# Altium project TSAL_New.PrjPcb
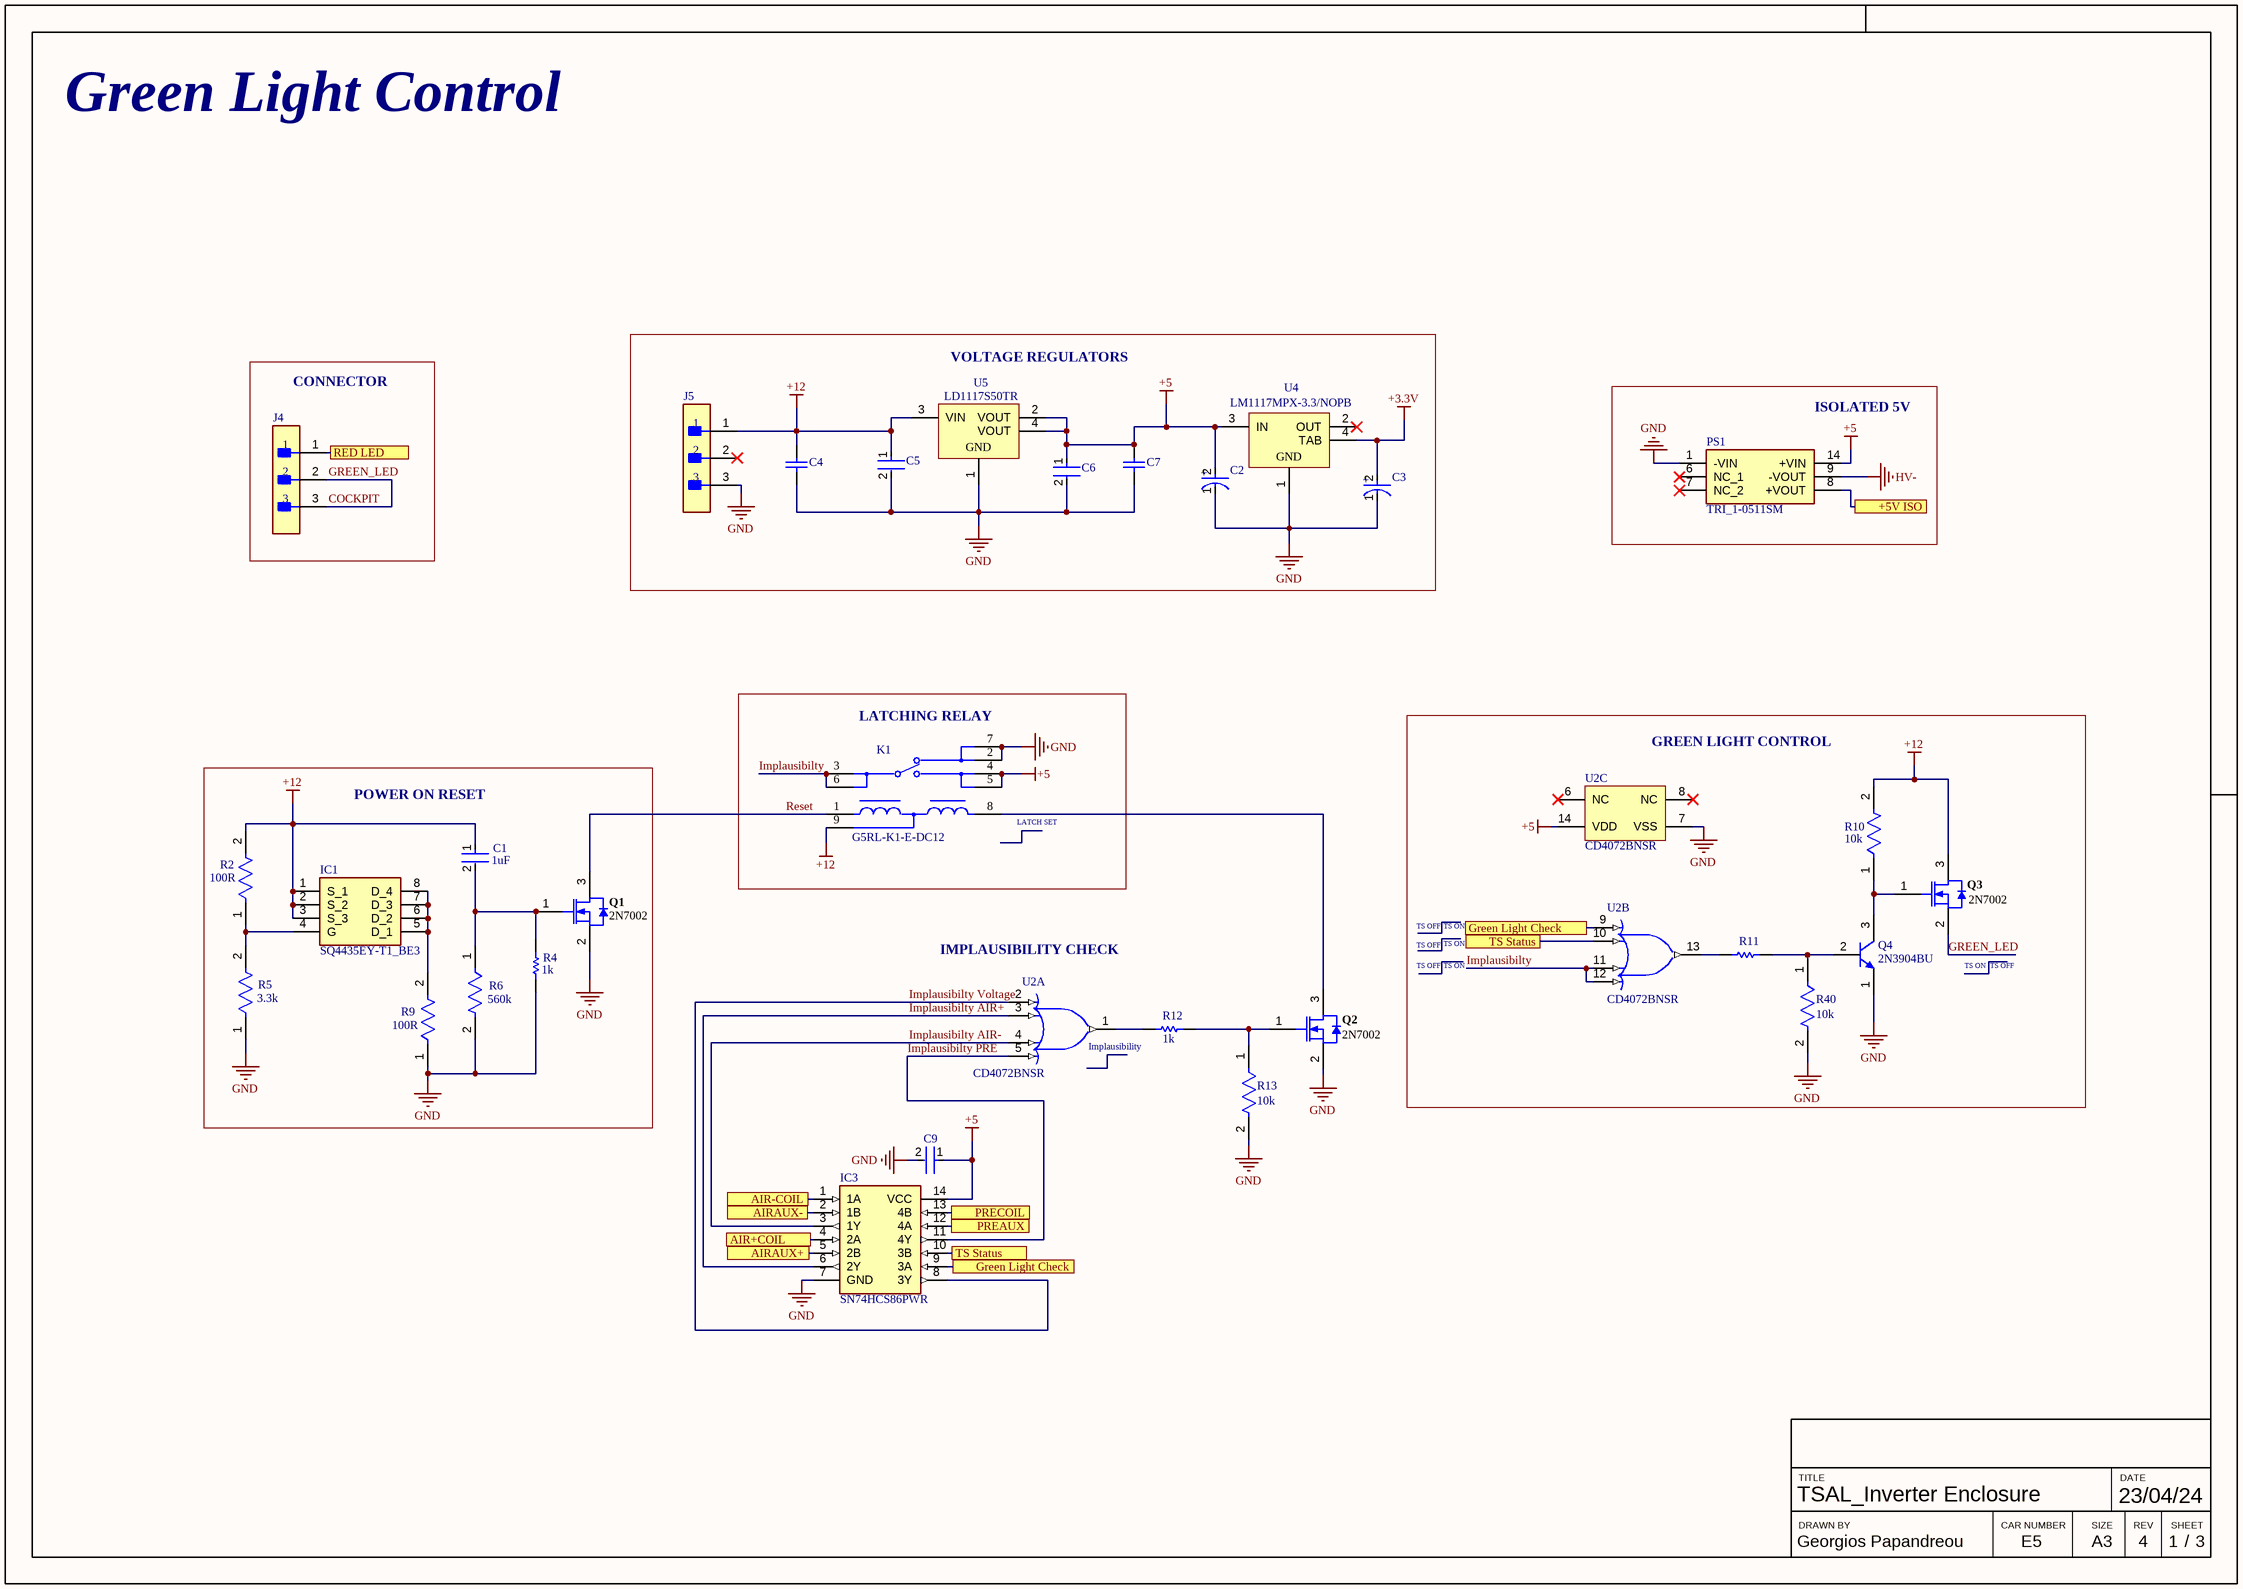
[diagram p0: Green_Light_Check.SchDoc]
CAGE_CODE: ?????; CONTRACT_NUMBER: <CONTRACT NO>; DOC_NO_ASSY_DWG: <ASSY DWG NO>; DOC_NO_BOM: <BOM DOC NO>; DOC_NO_FAB_DWG: <FAB DWG NO>; DOC_NO_SCH_DWG: <SCH DWG NO>; PCB_2_DEC_TOL: +/-.01; PCB_3_DEC_TOL: +/-.010; PCB_ANG_TOL: +/-1/2; PCB_ASSEMBLY_NO: <PCB ASSY NO>; PCB_CHECKER: - -----; PCB_CHECKER_APP_DATE: --/--/----; PCB_DESIGNER: - -----; PCB_DESIGNER_APP_DATE: --/--/----; PCB_DWG_NO: <PCB DWG NO>; PCB_ENGINEER: - -----; PCB_ENGINEER_APP_DATE: --/--/----; PCB_PART_NUMBER: <PCB PN>; PCB_REV: A; SCH_REV: A
4 sheets, 85 parts. Net scope: flat (ports and power ports of the same name join across sheets).
Board files: TSAL_New.PcbDoc, TSAL_ver2.PcbDoc
Sheets:
  Green_Light_Check.SchDoc
  Red_Light_Check.SchDoc
  TSAC_Logic.SchDoc
  CI.SchDoc

## Sheet Green_Light_Check.SchDoc: TSAL_Inverter Enclosure
size 420 x 297 mm; Date: 23/04/24; DrawnBy: Georgios Papandreou; Revision: 4; SheetNumber: 1; SheetTotal: 4; CarNum: E5; CurrentSheet: 1; TotalSheet: 3

### Parts
C1  CGA5L2X7R1E105K160AA  [FP-CGA5L-0_3-0_1-MFG]  (value not drawn)
C2  TAJP106M010RNJ  [FP-TAJP-MFG]  (value not drawn)
C3  TAJP106M010RNJ  [FP-TAJP-MFG]  (value not drawn)
C4  C1206C106K8RACTU  [CAPC3216X180X50LL20T25]  (value not drawn)
C5  CL21B104KBCNNNC  [FP-CL21-IPC_C]  (value not drawn)
C6  CL21B104KBCNNNC  [FP-CL21-IPC_C]  (value not drawn)
C7  C1206C106K8RACTU  [CAPC3216X180X50LL20T25]  (value not drawn)
C9  CL21B104KBCNNNC  [FP-CL21-IPC_C]  (value not drawn)
IC1  SQ4435EY-T1_BE3  [SOIC127P600X175-8N]
IC3  SN74HCS86PWR  [SOP65P640X120-14N]
J4  22-04-1031  [FP-22-04-1031-MFG]  (value not drawn)
J5  22-04-1031  [FP-22-04-1031-MFG]  (value not drawn)
K1  G5RL-K1-E-DC12  [FP-G5RL-K1-E-DC12-MFG]
PS1  TRI_1-0511SM  [TRI10511SM]
Q1  2N7002  [INF-PG-SOT23_M]
Q2  2N7002  [INF-PG-SOT23_M]
Q3  2N7002  [INF-PG-SOT23_M]
Q4  2N3904BU  [FAIR-TO-92]
R2  CRCW1206100RFKEA  [FP-CRCW1206-e3-MFG]  (value not drawn)
R4  1K 1% 1206(3216)  [RESC1206(3216)_N]  (value not drawn)
R5  CRCW12063K30FKEB  [FP-CRCW1206-e3-IPC_B]  (value not drawn)
R6  RT1206BRD07560KL  [FP-RT1206-MFG]  (value not drawn)
R9  CRCW1206100RFKEA  [FP-CRCW1206-e3-MFG]  (value not drawn)
R10  CRCW120610K0FKEA  [FP-CRCW1206-e3-IPC_C]  (value not drawn)
R11  RK73B2ATTD102J  [RESC2013X60X30ML20T20]  (value not drawn)
R12  RK73B2ATTD102J  [RESC2013X60X30ML20T20]  (value not drawn)
R13  CRCW120610K0FKEA  [FP-CRCW1206-e3-IPC_C]  (value not drawn)
R40  CRCW120610K0FKEA  [FP-CRCW1206-e3-IPC_C]  (value not drawn)
U2  CD4072BNSR  [NS0014A_M]  (parts A,B,C of 3)
U4  LM1117MPX-3.3/NOPB  [DCY0004A_L]
U5  LD1117S50TR  [SOT-223_L]

### Blocks framed on the sheet
CONNECTOR: J4
VOLTAGE REGULATORS: C2-C7 J5 U4 U5
ISOLATED 5V: PS1
LATCHING RELAY: K1
GREEN LIGHT CONTROL: Q3 Q4 R10 R11 R40 U2
POWER ON RESET: C1 IC1 Q1 R2 R4-R6 R9

### Ports
+5V ISO (see Red_Light_Check[3C], Red_Light_Check[4B], TSAC_Logic[4B], TSAC_Logic[5A]), AIR+COIL (see TSAC_Logic[4B]), AIR-COIL (see TSAC_Logic[4B]), AIRAUX+ (see TSAC_Logic[4B]), AIRAUX- (see TSAC_Logic[4B]), Green Light Check (see Green_Light_Check[3D], TSAC_Logic[4B]), Green Light Check (see Green_Light_Check[4C], TSAC_Logic[4B]), PREAUX (see TSAC_Logic[5B]), PRECOIL (see TSAC_Logic[5B]), RED LED (see Red_Light_Check[3C]), TS Status (see Green_Light_Check[3D], TSAC_Logic[6C]), TS Status (see Green_Light_Check[4C], TSAC_Logic[6C])

### Nets
+3.3V: C3.2(A) U4.4(TAB)
+5: C2.2(A) C6.1 C7.2 C9.1 IC3.14(VCC) K1.4 K1.5 PS1.14(+VIN) U2.14(VDD) U4.3(IN) U5.2(VOUT) U5.4(VOUT)
+12: C1.1 C4.2 C5.1 IC1.1(S_1) IC1.2(S_2) IC1.3(S_3) J5.1 K1.9(S+/R+) Q3.3(DRAIN) R2.2 R10.2 U5.3(VIN)
GND: C2.1(C) C3.1(C) C4.1 C5.2 C6.2 C7.1 C9.2 IC3.7(GND) J5.3 K1.2 K1.7 PS1.1(-VIN) Q1.2(SOURCE) Q2.2(SOURCE) Q4.1(E) R4.1 R5.1 R6.2 R9.1 R13.2 R40.2 U2.7(VSS) U4.1(GND) U5.1(GND)  [project net AIR+/AUX-]
HV-: PS1.9(-VOUT)
+5V ISO: PS1.8(+VOUT) ; port +5V ISO
AIR+COIL: IC3.4(2A) ; port AIR+COIL
AIR-COIL: IC3.1(1A) ; port AIR-COIL
AIRAUX+: IC3.5(2B) ; port AIRAUX+
AIRAUX-: IC3.2(1B) ; port AIRAUX-
COCKPIT: J4.2 J4.3 Q3.2(SOURCE)  [also labelled GREEN_LED]
Green Light Check: IC3.9(3A) U2.9(E) ; port Green Light Check
Implausibilty: K1.3 K1.6 U2.11(G) U2.12(H)
Implausibilty AIR+: IC3.6(2Y) U2.3(B)
Implausibilty AIR-: IC3.3(1Y) U2.4(C)
Implausibilty PRE: IC3.11(4Y) U2.5(D)
Implausibilty Voltage: IC3.8(3Y) U2.2(A)
PREAUX: IC3.12(4A) ; port PREAUX
PRECOIL: IC3.13(4B) ; port PRECOIL
RED LED: J4.1 ; port RED LED
Reset: K1.1(R-) Q1.3(DRAIN)
TS Status: IC3.10(3B) U2.10(F) ; port TS Status
NetC1_2: C1.2 Q1.1(GATE) R4.2 R6.1
NetIC1_4: IC1.4(G) R2.1 R5.2
NetIC1_5: IC1.5(D_1) IC1.6(D_2) IC1.7(D_3) IC1.8(D_4) R9.2
NetK1_8: K1.8(S-) Q2.3(DRAIN)
NetQ2_1: Q2.1(GATE) R12.2 R13.1
NetQ3_1: Q3.1(GATE) Q4.3(C) R10.1
NetQ4_2: Q4.2(B) R11.2 R40.1
NetR11_1: R11.1 U2.13(K)
NetR12_1: R12.1 U2.1(J)

Not connected (* = marked no-connect by the designer): J5 2*; PS1 6(NC_1)* 7(NC_2)*; U2 6(NC)* 8(NC)*; U4 2(OUT)*

### Notes on the sheet
- Green Light Control
- (near C1) 1uF
- (near K1) LATCH SET
- (near R10) 10k
- (near R2) 100R
- TS OFF
- TS ON
- (near R5) 3.3k
- (near R6) 560k
- (near R4) 1k
- (near U2) IMPLAUSIBILITY CHECK
- (near R9) 100R
- (near U2) Implausibility
- (near R12) 1k
- (near R40) 10k
- (near R13) 10k
- TITLE
- DATE
- DRAWN BY
- CAR NUMBER
- SIZE
- REV
- SHEET
- A3
- /
- (in symbol CMP-2007-04028-2) +

### Library data of the parts
C1 = CMP-08246-001699-1: Cap Ceramic 1uF 25V X7R 10% Pad SMD 1206 +125°C Automotive T/R; Max Operating Temperature: 125°C; Weight: 0.000571oz; Package Quantity: 2000; Width: 1.6mm; Voltage Rating: 25V; REACH SVHC: No SVHC; Height: 1.6mm; Min Operating Temperature: -55°C; Mount: Surface Mount; Case/Package: 1206; Ratings: AEC-Q200; Case Code (Imperial): 1206; Capacitance: 1uF; Termination: SMD/SMT; Length: 3.2mm; Depth: 1.6mm; Thickness: 0.075inch; Packaging: Tape and Reel; Tolerance: 10%; Dielectric: X7R; Case Code (Metric): 3216; Voltage Rating (DC): 25V; Composition: Ceramic
C2 C3 = CMP-2007-04028-2: 10uF 10V  ±20% 6Ω 0805  SMD Tantalum Capacitor; Dissipation Factor: 8%; ESR (Equivalent Series Resistance): 6R; Polarity: Polar; Leakage Current: 1uA; Height: 1.5mm; Packaging: Tape and Reel; Max Operating Temperature: 125°C; Lead Free: Lead Free; Length: 2.05mm; RoHS Compliant: Yes; Number of Pins: 2; Case Code (Metric): 2012; Series: TAJ; Height - Seated (Max): 0.059inch; Mount: Surface Mount; REACH SVHC: No SVHC; Depth: 1.35mm; Tolerance: 20%; Case Code (Imperial): 0805; Dielectric Material: Tantalum; Features: General Purpose; Voltage: 10V; Capacitance: 10uF; Package Quantity: 1; Case/Package: 0805; Voltage Rating (DC): 10V; Termination: SMD/SMT; Width: 0.053inch; Min Operating Temperature: -55°C; Voltage Rating: 10V
C4 C7 = CMP-2000-06013-1: Chip Capacitor, 10 uF, +/- 10%, 10 V, -55 to 125 degC, 1206 (3216 Metric), RoHS, Tape and Reel; Type: SMDMLCCX7R6.3-250VDCCommericalGrade; Class: Class1; Case Height: 1.6mm; Temperature Coefficient / Code: +/-15%; Capacitance: 10uF; Brand: Kemet; Case Length: 3.2mm; Dissipation Factor DF: 5; Voltage Rating: 10V; Dielectric: X7R; Tolerance: 10%; Package Reference: 1206; Dimensions: 1.6mmWx3.2mmLx1.6mmH; Series: C1206C; Minimum Operating Temperature: -55C; RoHS: Details; Termination Style: SMD/SMT; Mounting Technology: SurfaceMount; Manufacturer: Kemet; Product Category: MultilayerCeramicCapacitorsMLCC-SMD/SMT; Case Code - mm: 3216; Manufacturer URL: http://www.kemet.com/; Product: GeneralTypeMLCCs; Package Description: 2-Pin Surface Mount Device, Body 3.2 x 1.6 mm; Case Width: 1.6mm; Factory Pack Quantity: 2000; Package / Case: 1206(3216metric); Datasheet URL: http://www.kemet.com/docfinder?Partnumber=C1206C106K8RACTU; Datasheet Version: 02/2016; Operating Temperature Range: -55Cto+125C; Voltage Rating DC: 10V; Case Code - in: 1206; Maximum Operating Temperature: +125C; Packaging: Reel
C5 C6 C9 = CMP-2000-05017-2: CL21 Series 0805 100nF 50V ±10% Tolerance X7R Multilayer Ceramic Chip Capacitor; Depth: 1.25mm; Height: 0.85mm; Width: 0.049inch; Tolerance: 10%; Case Code (Metric): 2012; Case Code (Imperial): 0805; Material: Ceramic; Thickness: 0.037inch; Min Operating Temperature: -55°C; Contact Plating: Tin; Length: 2mm; Mount: Surface Mount; Voltage Rating (DC): 50V; Lead Free: Lead Free; Dielectric: X7R; Radiation Hardening: No; Capacitance: 100nF; Voltage Rating: 50V; Case/Package: 0805; Packaging: Tape and Reel; Max Operating Temperature: 125°C; Voltage: 50V
IC1 = SQ4435EY-T1_BE3: Integrated Circuit; Manufacturer_Name: Vishay; Datasheet Link: https://www.arrow.com/en/products/sq4435ey-t1-be3/vishay?region=nac; Height: 1.75mm; Manufacturer_Part_Number: SQ4435EY-T1_BE3; Mouser Part Number: 78-SQ4435EY-T1_BE3; Mouser Price/Stock: https://www.mouser.co.uk/ProductDetail/Vishay-Semiconductors/SQ4435EY-T1_BE3?qs=vmHwEFxEFR%2FvbkkgD6xsvQ%3D%3D; Arrow Part Number: SQ4435EY-T1_BE3; Arrow Price/Stock: https://www.arrow.com/en/products/sq4435ey-t1-be3/vishay?region=nac
IC3 = SN74HCS86PWR: Integrated Circuit; Manufacturer_Name: Texas Instruments; Datasheet Link: https://www.digikey.de/product-detail/de/texas-instruments/SN74HCS86PWR/296-SN74HCS86PWRCT-ND/11615756; Height: 1.2mm; Manufacturer_Part_Number: SN74HCS86PWR; Mouser Part Number: 595-SN74HCS86PWR; Mouser Price/Stock: https://www.mouser.co.uk/ProductDetail/Texas-Instruments/SN74HCS86PWR?qs=GBLSl2Akirvjol1GHn5SIA%3D%3D; Arrow Part Number: SN74HCS86PWR; Arrow Price/Stock: https://www.arrow.com/en/products/sn74hcs86pwr/texas-instruments?region=nac
J4 J5 = CMP-04776-000410-1: CONN HEADER VERT 3POS 2.5MM; Voltage Rating (AC): 250V; Number of Contacts: 3; Max Voltage Rating (DC): 250.25kV; Contact Resistance: 20mR; Hole Diameter: 1.19mm; Gender: Male; Connector Type: Male Pin; Insulation Resistance: 1GR; Glow Wire Compliant: Non-compliant; Current Rating: 3A; Contact Material: Brass; Series: KK; Number of Positions: 3; Contact Gender: Male; Mount: Through Hole; Working Voltage: 250V; Number of Poles: 3; Termination: Solder; Radiation Hardening: No; Lead Free: Lead Free; Min Operating Temperature: -40°C; Contact Mating Length: 0.295inch; Packaging: Bulk; Lead Pitch: 2.5mm; Voltage Rating: 250V; Voltage Rating (DC): 250V; Orientation: Straight; Color: Natural; Flammability Rating: UL94 V-0; Housing Material: Nylon; Pitch: 2.5mm; Contact Type: Male Pin; Number of Rows: 1; Housing Color: Natural; Max Operating Temperature: 105°C; Fastening Type: Friction; Halogen Free: Low Halogen; Contact Plating: Tin; Package Quantity: 1; Number of Circuits: 3
K1 = CMP-08822-000183-1: RELAY GEN PURPOSE SPDT 16A 12V; Relay Type: General Purpose; Coil Type: Latching, Dual Coil; Coil Resistance: 192R; Release Time: 15ms; Coil Current: 62.5mA; Coil Power: 750mW; Contact Current Rating: 16A; Termination: PC Pin; Max Operating Temperature: 85°C; Min Operating Temperature: -40°C; Mount: Through Hole; Coil Voltage (DC): 12V; Operate Time: 15ms; REACH SVHC: No SVHC; Packaging: Rail/Tube; Throw Configuration: SPDT; Package Quantity: 100; Contact Material: Silver
PS1 = TRI_1-0511SM: Power Supply; Manufacturer_Name: Traco Power; Manufacturer_Part_Number: TRI 1-0511SM; Datasheet Link: https://tracopower.com/tri1sm-datasheet/; Height: 11mm
Q1-Q3 = CMP-1149-00026-1: N-Channel OptiMOS Small-Signal-Transistor, 60 V VDS, 0.3 A ID, -55 to 150 degC, PG-SOT23, Reel, Green; Manufacturer: Infineon; RDS (on) (max) (@4.5V): 4,000 mOhm; VDS (max): 60 V; IDpuls (max): 1.2Â A; QG: 0.4Â nC; RDS (on) (max): 3,000 mOhm; RthJA (max): 250 K/W; ID (max): 0.3Â A; VGS(th) (max): 2.5Â V; VGS(th) (min): 1.5Â V; Green: TRUE; Ptot (max): 0.5Â W; PackageDescription: 3-Pin Small Outline Transistor Package, 2.9 x 1.3 mm Body, 0.95 mm Pitch; Halogen-free: TRUE; ComponentLink2Description: Datasheet; ComponentLink1URL: http://www.infineon.com/; Packing: Reel; DatasheetVersion: Rev. 2.4; PartNumber: 2N7002; PackageReference: PG-SOT23; PackageVersion: Apr-08; ComponentLink3URL: http://www.infineon.com/dgdl/SOT23-Package_Overview.pdf?folderId=db3a30431936bc4b0119532290053c66&fileId=db3a30431936bc4b0119533468123c85; ComponentLink1Description: Manufacturer URL; Mounting Technology: Surface Mount; ComponentLink3Description: Package Specification; ComponentLink2URL: http://www.infineon.com/dgdl/2N7002_Rev2.4.pdf?folderId=db3a3043156fd573011622e10b5c1f67&fileId=db3a304319bc939a0119c2a9461e79e6
Q4 = CMP-2000-04944-1: NPN General-Purpose Amplifier, 40 V VCEO, 0.2 A, -55 to 150 degC, 2-Pin TO-92, RoHS, Bulk; Manufacturer: FairchildSemiconductor; Maximum Collector Base Voltage: 60V; Minimum DC Current Gain: 40@0.1mA@1V; Maximum Collector Emitter Voltage: 40V; Maximum DC Collector Current: 0.2A; Rad Hard: No; Maximum Operating Frequency: 300(Min)MHz; Maximum Collector Emitter Saturation Voltage: 0.2@1mA@10mA; Maximum Power Dissipation: 625mW; Package Description: 3-Pin Transistor Outline Package, Body Dia 4.79 mm, Pitch 1.27 mm; Package Reference: TO-92; Pin Count: 3; Operating Temperature: -55to150degC; Category: GPBJT; Manufacturer URL: https://www.fairchildsemi.com/; Datasheet URL: https://datasheet.ciiva.com/4722/2n3904-82270-4722369.pdf; Package: 3TO-92; Packaging: Bulk; Type: NPN; Datasheet Version: Rev. 1.1.0, 10/2014; Mounting: ThroughHole
R2 R9 = CMP-2003-04801-2: RES Thick Film, 100Ω, 1%, 0.25W, 100ppm/°C, 1206; Voltage Rating (DC): 200V; Resistance: 100R; Power Rating: 250mW; Case Code (Metric): 3216; Radiation Hardening: No; Height: 0.55mm; Packaging: Tape and Reel; Depth: 1.6mm; Weight: 0.000353oz; Termination: SMD/SMT; Lead Free: Lead Free; Min Operating Temperature: -55°C; Contact Plating: Tin; Max Operating Temperature: 155°C; Case Code (Imperial): 1206; Military Standard: Not; Width: 1.6mm; Number of Pins: 2; Voltage Rating: 200V; Composition: Thick Film; Package Quantity: 5000; Tolerance: 1%; Case/Package: 1206; Mount: Surface Mount; Length: 3.2mm; Temperature Coefficient: 100ppm/°C
R4 = CMP-1014-00510-1: 1K 0.25W 1% 1206 (3216 Metric)  SMD; Case-Metric: 3216; Case-EIA: 1206; Value: 1000.00 Ohm; Power: 0.25 W; Tolerance: 1 %; Technology: SMT
R5 = CMP-02407-003770-1: RES Thick Film, 3.3kΩ, 1%, 0.25W, 100ppm/°C, 1206; Voltage Rating: 200V; Max Power Dissipation: 250mW; Resistance: 3.3kR; Temperature Coefficient: 100ppm/°C; Width: 0.063inch; Package Quantity: 10000; Min Operating Temperature: -55°C; Lead Free: Lead Free; Packaging: Tape and Reel; Termination: SMD/SMT; Max Operating Temperature: 155°C; Case Code (Imperial): 1206; Height: 0.024inch; Case/Package: 1206; Case Code (Metric): 3216; Features: Automotive AEC-Q200; Tolerance: 1%; Power Rating: 250mW; Composition: Thick Film; Weight: 0.000353oz; Length: 0.126inch; Number of Terminations: 2
R6 = CMP-2003-04198-2: RES SMD 560K OHM 0.1% 1/4W 1206; Manufacturer: Yageo; Power Rating: 0.25W; Value: 560KΩ; Voltage Rating: 200V; Temperature Coefficient: 25 ppm/°C; Tolerance: 0.005; Temperature Range Low: -55°C; Device Class L2: Resistors; ComponentLink2Description: Datasheet; Height: 0.65mm; Mouser Description: Res SMD 560K Ohm 0.1% 1/8W 1206; Temperature: -55°C to +155°C; Footprint Url: http://www.yageo.com/exep/pages/download/literatures/PYu-R_Mount_10.pdf; Resistance: 560KΩ; Device Class L3: Chip SMD Resistors; Category: Res; Manufacturer Part Number: RT1206BRD07560KL; RoHS: TRUE; Device Class L1: Passive Components; Digikey Description: RES SMD 560K OHM 0.1% 1/4W 1206; Package: RT1206; Automotive: No; ComponentLink2URL: http://www.yageo.com/documents/recent/PYu-RT_1-to-0.01_RoHS_L_9.pdf; Series: RT; Temperature Range High: +155°C; Octopart: https://octopart.com/rt1206brd07560kl-yageo-1212973; Composition: Thin Film; Lead Free: Yes; Ipc Land Pattern Name: RESC310160X55
R10 R13 R40 = CMP-2003-04807-2: RES Thick Film, 10kΩ, 1%, 0.25W, 100ppm/°C, 1206; Working Voltage: 200V; Max Power Dissipation: 250mW; Resistance: 10kR; Tolerance: 1%; Width: 0.063inch; Height: 0.55mm; Number of Pins: 2; Voltage Rating: 200V; Temperature Coefficient: 100ppm/°C; Military Standard: Not; Features: Automotive AEC-Q200; Depth: 1.6mm; Radiation Hardening: No; Termination: SMD/SMT; Case Code (Imperial): 1206; Weight: 0.000353oz; Length: 3.2mm; Package Quantity: 10; Voltage Rating (DC): 200V; Case/Package: 1206; Min Operating Temperature: -55°C; Number of Terminations: 2; Composition: Thick Film; Contact Plating: Tin; Power Rating: 250mW; Packaging: Tape and Reel; Max Operating Temperature: 155°C; Lead Free: Lead Free; Case Code (Metric): 3216
R11 R12 = CMP-2001-04656-1: Manufacturer: KOA Speer; Part Number: RK73B2ATTD102J
U2 = CMP-1573-00167-4: CMOS Dual 4-Input OR Gate, NS0014A, LARGE T&R; Manufacturer: Texas Instruments; Rating: Catalog; ICC @ Nom Voltage(Max)(mA): 0.015; VCC(Max)(V): 18; Bits(#): 2; tpd @ Nom Voltage(Max)(ns): 120; VCC(Min)(V): 3; F @ Nom Voltage(Max)(Mhz): 8; Voltage(Nom)(V): 10; Output Drive (IOL/IOH)(Max)(mA): 1.5/-1.5; DatasheetVersion: SCHS056D; Output Type: CMOS; PackageVersion: http://www.ti.com/lit/ml/msop002a/msop002a.pdf; PackageReference: NS0014A; Operating Temperature Range(C): -55 to 125; Input Type: CMOS; Generic Part Number: CD4072B
U4 = CMP-0062-01639-4: 800mA Low-Dropout Linear Regulator, 4-pin SOT-223, Pb-Free; Manufacturer: Texas Instruments; High-Reliability: Y; PowerWise: N; PackageTopMarking: XYTT*N05A; CompType: LDO IC; ComponentLink1URL: http://www.ti.com/general/docs/lit/getliterature.tsp?genericPartNumber=LM1117-N&fileType=pdf; PartNumber: LM1117MPX-3.3/NOPB; ComponentLink1Description: Datasheet URL; PinCount: 4; Code_JEDEC: TO-261-AA; PackageDescription: Molded SOT-223, 6.50 x 3.56 x 1.6mm Body, 4 Lead, 2.3mm Pitch; PackageReference: DCY0004A; RoHS: Y; Code_IPC: SOT223-4
U5 = CMP-0244-00312-1: Fixed Low Drop Positive Voltage Regulator, 5V, 4-Pin SOT-223, Tape and Reel; ComponentLink1URL: http://www.st.com; DatasheetVersion: 1/11/2011; PackageDescription: 4-Pin SOT-223 Package, 6.5 x 3.5 mm Body, 2.3 mm Pitch, 7 mm Lead Span; ComponentLink2URL: http://www.st.com/internet/com/TECHNICAL_RESOURCES/TECHNICAL_LITERATURE/DATASHEET/CD00000544.pdf; ComponentLink1Description: Manufacturer URL; PackageReference: SOT-223; PackageVersion: 2010; ComponentLink2Description: Datasheet

## Sheet Red_Light_Check.SchDoc: TSAL_Inverter Enclosure
size 420 x 297 mm; Date: 23/04/24; DrawnBy: Georgios Papandreou; Revision: 4; SheetNumber: 2; SheetTotal: 4; CarNum: E5; CurrentSheet: 2; TotalSheet: 3
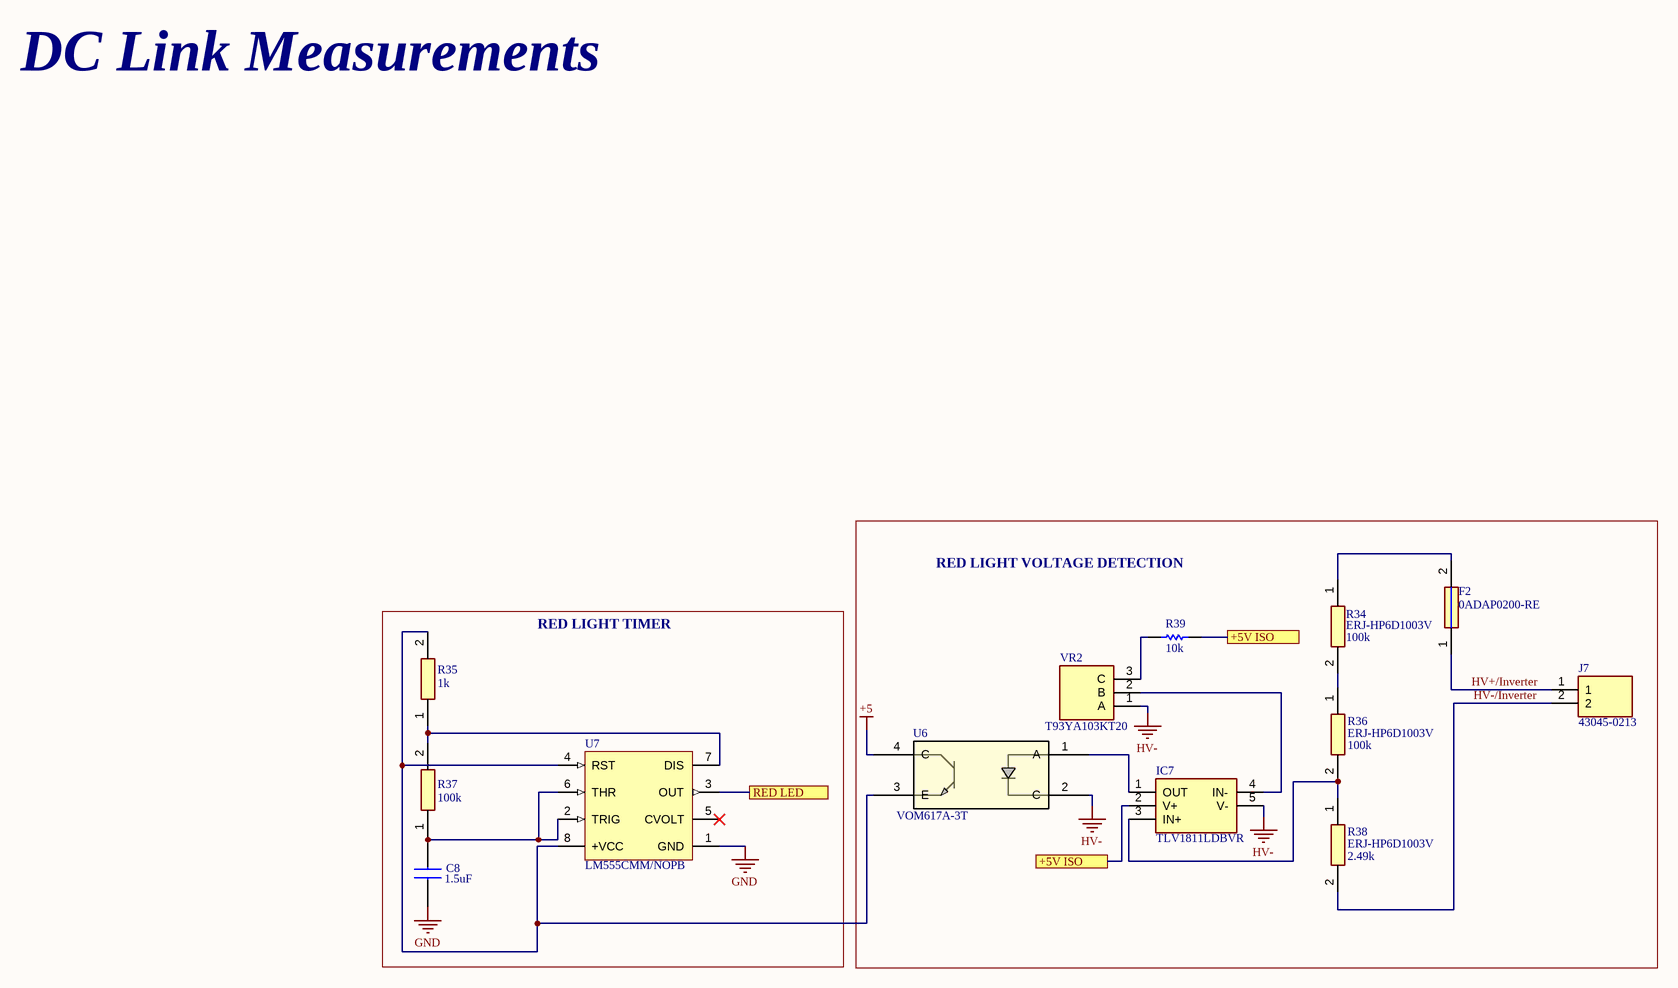
[diagram p1: Red_Light_Check.SchDoc]

### Parts
C8  C1005X6S0G155M050BC  [CAPC1005X55N]  (value not drawn)
F2  0ADAP0200-RE  [0ADAP0200RE]
IC7  TLV1811LDBVR  [SOT95P280X145-5N]
J7  43045-0213  [43045-02YY_121314]
R34  ERJ-HP6D1003V  [ERJHP6D1000V]
R35  RA73F1J1K0BTDF  [RESC1608X58N]  (value not drawn)
R36  ERJ-HP6D1003V  [ERJHP6D1000V]
R37  RK73H2ATTD1003F  [RESC2012X60N]  (value not drawn)
R38  ERJ-HP6D1003V  [ERJHP6D1000V]
R39  CRCW080510K0FKEC  [RESC2013X50X30ML20T20]  (value not drawn)
U6  VOM617A-3T  [SMD-4_VOM617A_VIS]
U7  LM555CMM/NOPB  [DGK0008A_N]
VR2  T93YA103KT20  [T93YA5K10]

### Blocks framed on the sheet
RED LIGHT VOLTAGE DETECTION: F2 IC7 J7 R34 R36 R38 R39 U6 VR2
RED LIGHT TIMER: C8 R35 R37 U7

### Ports
+5V ISO (see Green_Light_Check[5B], Red_Light_Check[3C], TSAC_Logic[4B], TSAC_Logic[5A]), +5V ISO (see Green_Light_Check[5B], Red_Light_Check[4B], TSAC_Logic[4B], TSAC_Logic[5A]), RED LED (see Green_Light_Check[1B])

### Nets
+5: U6.4(C)
GND: C8.1 U7.1(GND)  [project net AIR+/AUX-]
HV-: IC7.5(V-) U6.2(C) VR2.1(A)
+5V ISO: IC7.2(V+) R39.1 ; port +5V ISO
HV+/Inverter: F2.1 J7.1
HV-/Inverter: J7.2 R38.2
RED LED: U7.3(OUT) ; port RED LED
NetC8_2: C8.2 R37.1 U7.2(TRIG) U7.6(THR)
NetF2_2: F2.2 R34.1
NetIC7_1: IC7.1(OUT) U6.1(A)
NetIC7_3: IC7.3(IN+) R36.2 R38.1
NetIC7_4: IC7.4(IN-) VR2.2(B)
NetR34_2: R34.2 R36.1
NetR35_1: R35.1 R37.2 U7.7(DIS)
NetR35_2: R35.2 U6.3(E) U7.4(RST) U7.8(+VCC)
NetR39_2: R39.2 VR2.3(C)

Not connected (* = marked no-connect by the designer): U7 5(CVOLT)*

### Notes on the sheet
- DC Link Measurements
- (near R39) 10k
- (near R34) 100k
- (near R35) 1k
- (near R37) 100k
- (near R36) 100k
- (near R38) 2.49k
- (near C8) 1.5uF
- TITLE
- DATE
- DRAWN BY
- CAR NUMBER
- SIZE
- REV
- SHEET
- A3
- /

### Library data of the parts
C8 = C1005X6S0G155M050BC: MULTILAYER CERAMIC CHIP CAPACITORS, 1005, Commercial grade, general (Up to 75V); Manufacturer_Name: TDK; Geometry.Height: 0.55mm; Mouser Part Number: *; Mouser Price/Stock: *; Manufacturer_Part_Number: C1005X6S0G155M050BC; Datasheet Link: https://product.tdk.com/info/en/catalog/datasheets/mlcc_commercial_midvoltage_en.pdf
F2 = 0ADAP0200-RE: Fuse; Manufacturer_Name: BelFuse; Datasheet Link: https://www.belfuse.com/resources/datasheets/circuitprotection/ds-cp-0adax-series.pdf; Height: 7.06mm; Manufacturer_Part_Number: 0ADAP0200-RE; Mouser Part Number: 530-0ADAP0200-RE; Mouser Price/Stock: https://www.mouser.co.uk/ProductDetail/Bel-Fuse/0ADAP0200-RE?qs=chTDxNqvsylLbV%252B5gr9f%252Bw%3D%3D; Arrow Part Number: 0ADAP0200-RE; Arrow Price/Stock: https://www.arrow.com/en/products/0adap0200-re/bel-group
IC7 = TLV1811LDBVR: Integrated Circuit; Manufacturer_Name: Texas Instruments; Datasheet Link: https://www.ti.com/lit/ds/symlink/tlv1811.pdf?ts=1674252464539&ref_url=https%253A%252F%252Fwww.ti.com%252Fproduct%252FTLV1811; Height: 1.45mm; Manufacturer_Part_Number: TLV1811LDBVR; Mouser Part Number: 595-TLV1811LDBVR; Mouser Price/Stock: https://www.mouser.co.uk/ProductDetail/Texas-Instruments/TLV1811LDBVR?qs=rQFj71Wb1eX09MzTfpxERg%3D%3D; Arrow Part Number: TLV1811LDBVR; Arrow Price/Stock: https://www.arrow.com/en/products/tlv1811ldbvr/texas-instruments?region=nac
J7 = 43045-0213: Connector; Manufacturer_Name: Molex; Datasheet Link: https://www.molex.com/pdm_docs/sd/430450612_sd.pdf; Height: 9.91mm; Manufacturer_Part_Number: 43045-0213; Mouser Part Number: 538-43045-0213; Mouser Price/Stock: https://www.mouser.co.uk/ProductDetail/Molex/43045-0213?qs=4XSMV6Twtb2ziNgaS7IgsA%3D%3D
R34 R36 R38 = CMP-067-000016-1: Resistor; Manufacturer_Name: Panasonic; Source: SamacSys.SchLib; Height: 0.7mm; Design Item ID: ERJ-HP6D1003V; Datasheet Link: http://industrial.panasonic.com/cdbs/www-data/pdf/RDQ0000/ast-ind-151033.pdf; Manufacturer_Part_Number: ERJ-HP6D1003V
R35 = RA73F1J1K0BTDF: Resistor; Manufacturer_Name: TE Connectivity; Datasheet Link: https://www.te.com/commerce/DocumentDelivery/DDEController?Action=srchrtrv&DocNm=1773270-3&DocType=Data%20Sheet&DocLang=English&PartCntxt=2-2176474-6&DocFormat=pdf; Height: 0.58mm; Manufacturer_Part_Number: RA73F1J1K0BTDF; Mouser Part Number: 279-RA73F1J1K0BTDF; Mouser Price/Stock: https://www.mouser.co.uk/ProductDetail/TE-Connectivity-Holsworthy/RA73F1J1K0BTDF?qs=Li%252BoUPsLEnve%2FJ8%252BWostNg%3D%3D
R37 = RK73H2ATTD1003F: Resistor; Manufacturer_Name: KOA Speer; Datasheet Link: http://www.koaspeer.com/catimages/Products/RK73H/RK73H.pdf; Height: 0.6mm; Manufacturer_Part_Number: RK73H2ATTD1003F; Mouser Part Number: 660-RK73H2ATTD1003F; Mouser Price/Stock: https://www.mouser.co.uk/ProductDetail/KOA-Speer/RK73H2ATTD1003F?qs=tLTLU8dkiwvHIdNanXejgQ%3D%3D; Arrow Part Number: RK73H2ATTD1003F; Arrow Price/Stock: https://www.arrow.com/en/products/rk73h2attd1003f/koa-speer-electronics?region=nac
R39 = CMP-1013-00623-2: Manufacturer: Vishay Dale; Part Number: CRCW080510K0FKEC
U6 = CMP-00030-45523145-1: VOM617A-3T Transistor Output Optocoupler, 1-Element, 3750V Isolation; Isolation Voltage: 3.75kV; Max Power Dissipation: 170mW; Max Output Voltage: 80V; Output Current per Channel: 100mA; Collector Emitter Saturation Voltage: 400mV; Number of Elements: 1; Max Input Current: 60mA; Fall Time: 12µs; Rise Time: 7µs; Forward Voltage: 1.6V; Current Transfer Ratio: 200%; Reverse Breakdown Voltage: 6V; Lead Free: Lead Free; Case/Package: SOP; Mount: Surface Mount; Min Operating Temperature: -55°C; Radiation Hardening: No; Width: 3.85mm; REACH SVHC: Unknown; Schedule B: 8541408000, 8541408000; Number of Pins: 4; Collector Emitter Breakdown Voltage: 80V; Forward Current: 60mA; Number of Channels: 1; RoHS: Compliant; Power Dissipation: 170mW; NexarPartId: 45523145; Length: 4.4mm; Input Current: 60mA; Collector Emitter Voltage (VCEO): 80V; Max Operating Temperature: 110°C; Output Voltage: 80V; Packaging: Tape & Reel; Max Collector Current: 100mA; Height: 2mm; Reverse Voltage (DC): 6V
U7 = CMP-0056-00152-3: Timer, 8-pin Mini SOIC, Pb-Free; Manufacturer: Texas Instruments; CompType: Analog IC; PowerWise: N; PackageTopMarking: ZXTT*Z55; ComponentLink1URL: http://www.ti.com/general/docs/lit/getliterature.tsp?genericPartNumber=LM555&fileType=pdf; PackageDescription: MINI SOIC, .118 x .118 x .034in, 8 Lead, .0256in Pitch; PinCount: 8; RoHS: Y; ComponentLink1Description: Datasheet URL; PackageReference: DGK0008A; Code_JEDEC: MO-187-AA
VR2 = T93YA103KT20: Variable Resistor; Manufacturer_Name: Vishay; Datasheet Link: https://www.vishay.com/docs/51026/t93.pdf; Height: 9mm; Manufacturer_Part_Number: T93YA103KT20; Mouser Part Number: 72-T93YA-10K; Mouser Price/Stock: https://www.mouser.co.uk/ProductDetail/Vishay-Sfernice/T93YA103KT20?qs=h4f6qdGYbthXcbdd7vDO0Q%3D%3D; Arrow Part Number: T93YA103KT20; Arrow Price/Stock: https://www.arrow.com/en/products/t93ya103kt20/vishay?region=nac

## Sheet TSAC_Logic.SchDoc: TSAL_Inverter Enclosure
size 420 x 297 mm; Date: 23/04/24; DrawnBy: Georgios Papandreou; Revision: 4; SheetNumber: 3; SheetTotal: 4; CarNum: E5; CurrentSheet: 3; Totalsheet: 3
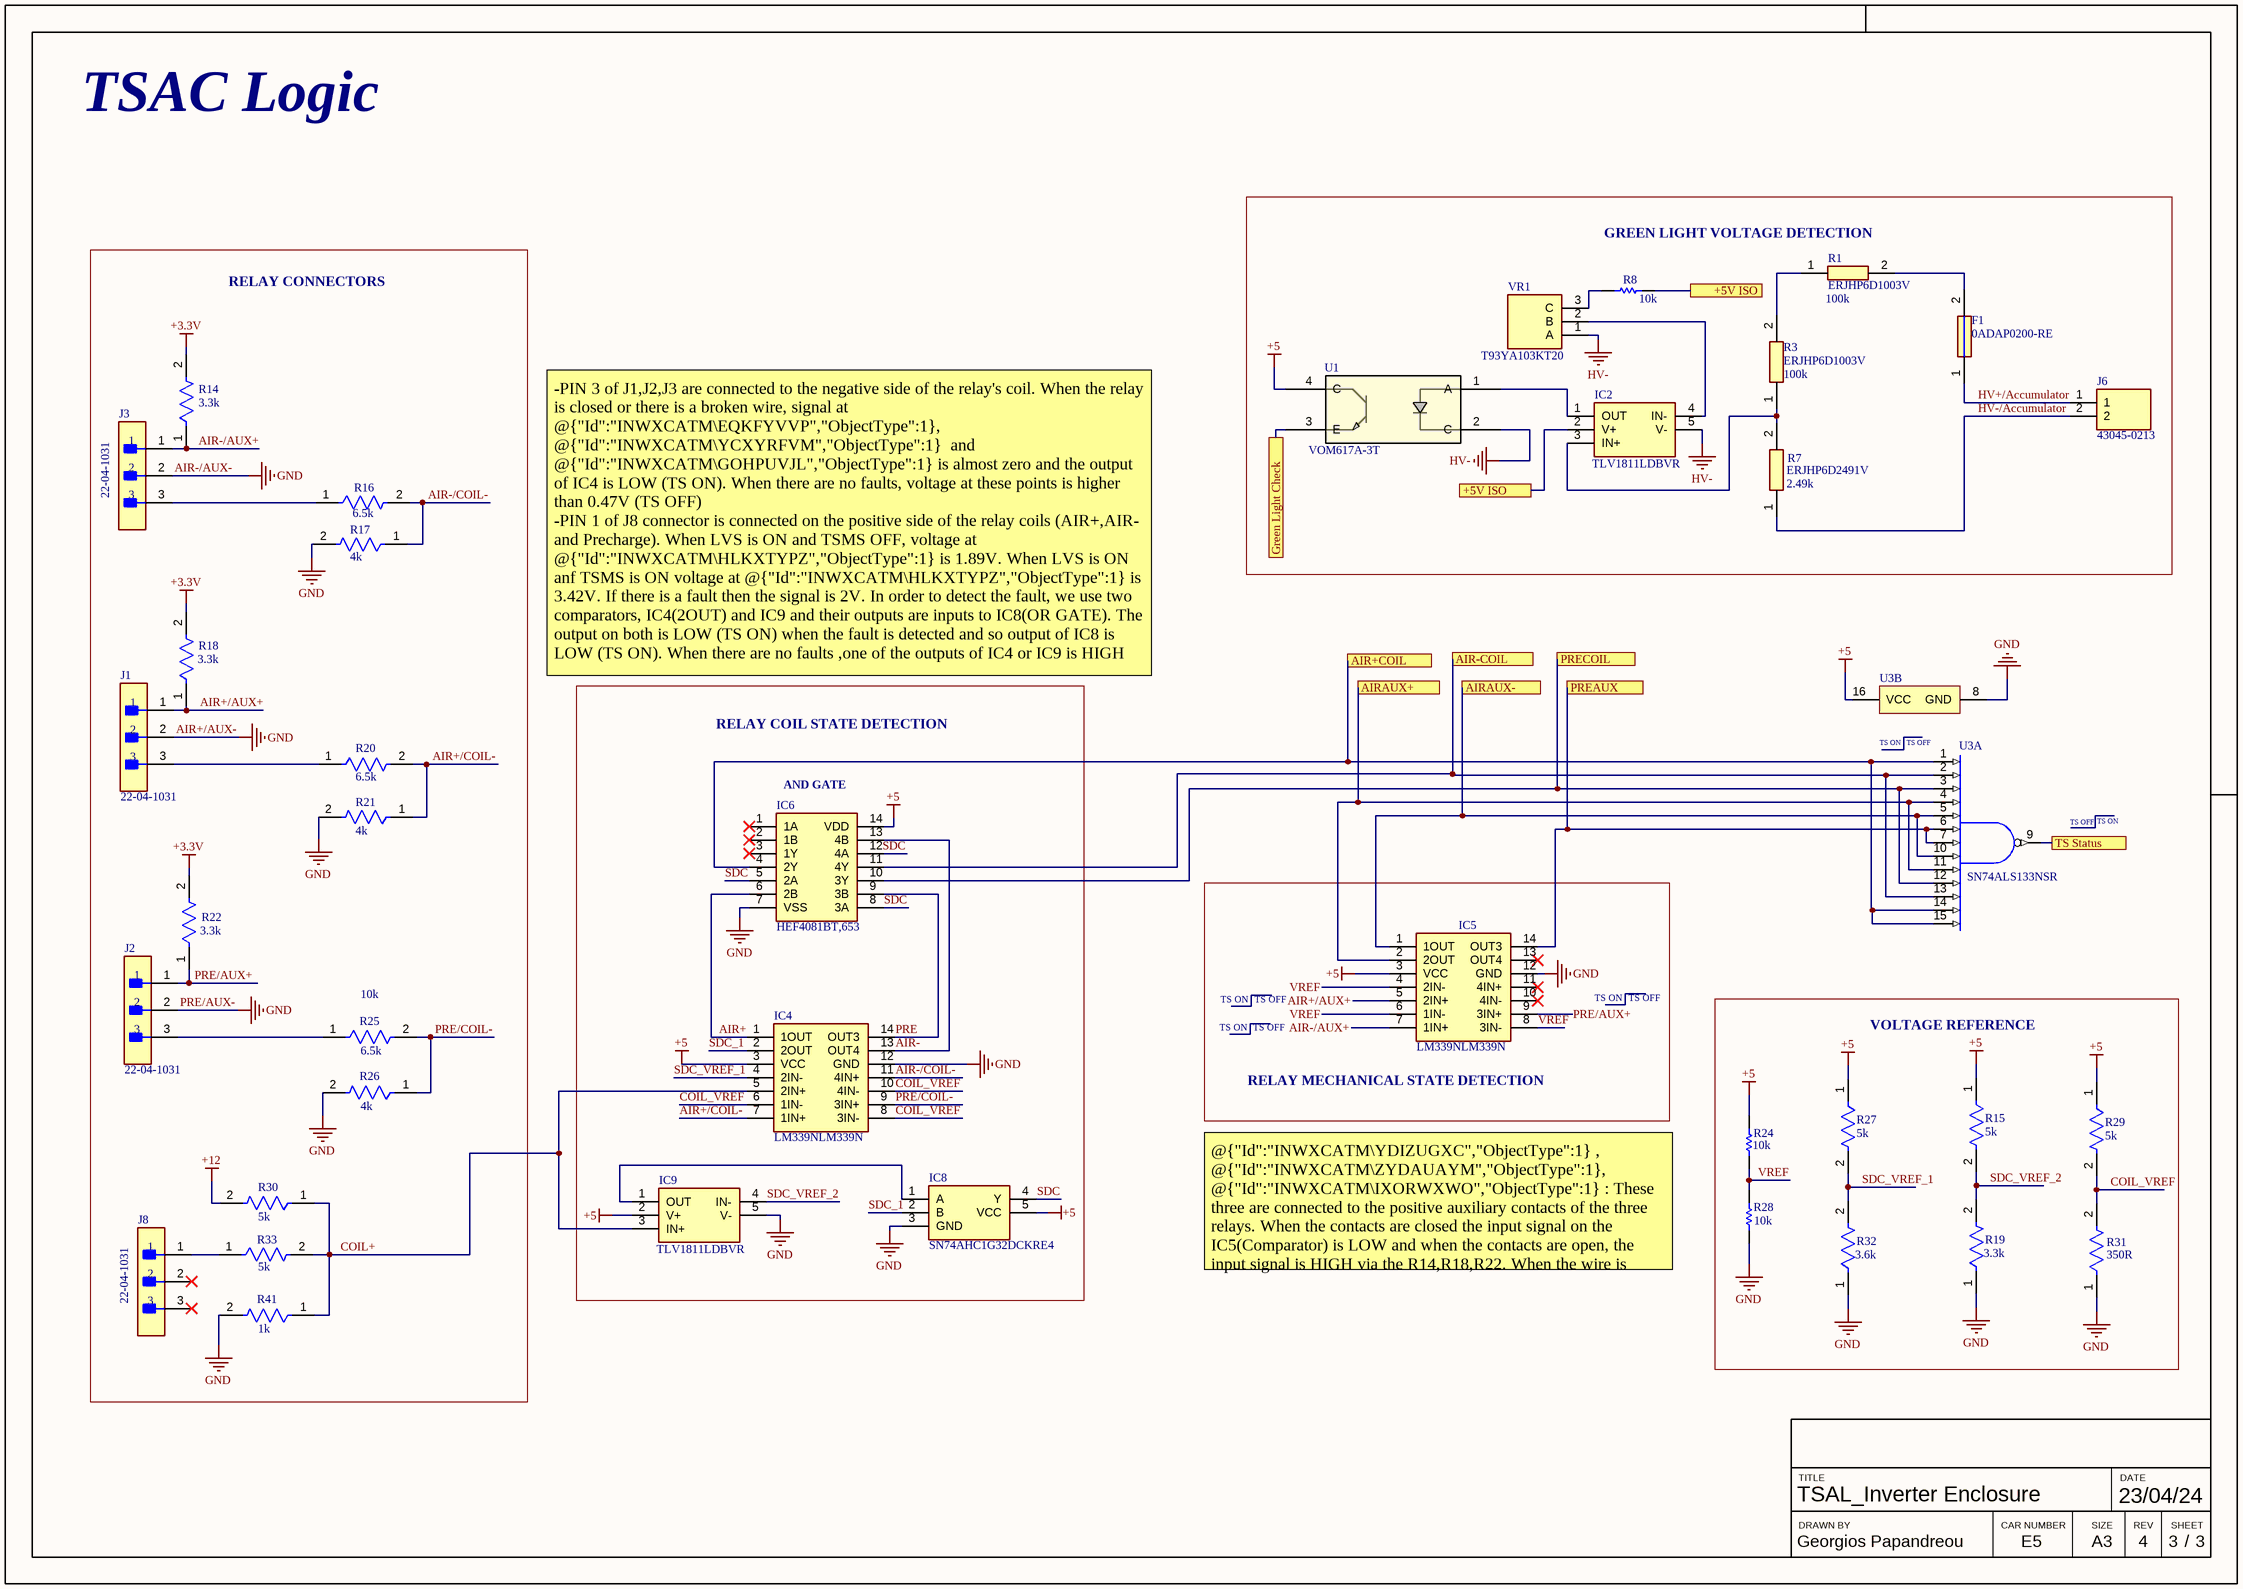
[diagram p2: TSAC_Logic.SchDoc]

### Parts
F1  0ADAP0200-RE  [0ADAP0200RE]
IC2  TLV1811LDBVR  [SOT95P280X145-5N]
IC4  LM339NLM339N  [DIP794W53P254L1930H508Q14N]
IC5  LM339NLM339N  [DIP794W53P254L1930H508Q14N]
IC6  HEF4081BT,653  [SOIC127P600X175-14N]
IC8  SN74AHC1G32DCKRE4  [SOT65P210X110-5N]
IC9  TLV1811LDBVR  [SOT95P280X145-5N]
J1  22-04-1031  [FP-22-04-1031-MFG]
J2  22-04-1031  [FP-22-04-1031-MFG]
J3  22-04-1031  [FP-22-04-1031-MFG]
J6  43045-0213  [43045-02YY_121314]
J8  22-04-1031  [FP-22-04-1031-MFG]
R1  ERJHP6D1003V  [ERJHP6D1000V]
R3  ERJHP6D1003V  [ERJHP6D1000V]
R7  ERJHP6D2491V  [ERJHP6D1000V]
R8  CRCW080510K0FKEC  [RESC2013X50X30ML20T20]  (value not drawn)
R14  CRCW08053K30FKEC  [FP-CRCW0805-e3-MFG]  (value not drawn)
R15  CRCW080520K0JNEB  [FP-CRCW0805-e3-IPC_B]  (value not drawn)
R16  CRCW120610K0FKEA  [FP-CRCW1206-e3-IPC_C]  (value not drawn)
R17  RN732BTTD4001B25  [FP-RN732B-IPC_C]  (value not drawn)
R18  CRCW08053K30FKEC  [FP-CRCW0805-e3-MFG]  (value not drawn)
R19  CRCW120610K0FKEA  [FP-CRCW1206-e3-IPC_C]  (value not drawn)
R20  CRCW120610K0FKEA  [FP-CRCW1206-e3-IPC_C]  (value not drawn)
R21  RN732BTTD4001B25  [FP-RN732B-IPC_C]  (value not drawn)
R22  CRCW08053K30FKEC  [FP-CRCW0805-e3-MFG]  (value not drawn)
R24  CRCW080510K0FKEC  [RESC2013X50X30ML20T20]  (value not drawn)
R25  CRCW120610K0FKEA  [FP-CRCW1206-e3-IPC_C]  (value not drawn)
R26  RN732BTTD4001B25  [FP-RN732B-IPC_C]  (value not drawn)
R27  CRCW080520K0JNEB  [FP-CRCW0805-e3-IPC_B]  (value not drawn)
R28  CRCW080510K0FKEC  [RESC2013X50X30ML20T20]  (value not drawn)
R29  CRCW080520K0JNEB  [FP-CRCW0805-e3-IPC_B]  (value not drawn)
R30  CRCW080520K0JNEB  [FP-CRCW0805-e3-IPC_B]  (value not drawn)
R31  MCA12060D8000BP500  [FP-MCA1206-IPC_C]  (value not drawn)
R32  CRCW120610K0FKEA  [FP-CRCW1206-e3-IPC_C]  (value not drawn)
R33  CRCW120610K0FKEA  [FP-CRCW1206-e3-IPC_C]  (value not drawn)
R41  RN732BTTD4001B25  [FP-RN732B-IPC_C]  (value not drawn)
U1  VOM617A-3T  [SMD-4_VOM617A_VIS]
U3  SN74ALS133NSR  [NS0016A_M]  (parts A,B of 2)
VR1  T93YA103KT20  [T93YA5K10]

### Blocks framed on the sheet
GREEN LIGHT VOLTAGE DETECTION: F1 IC2 J6 R1 R3 R7 R8 U1 VR1
RELAY CONNECTORS: J1-J3 J8 R14 R16-R18 R20-R22 R25 R26 R30 R33 R41
RELAY COIL STATE DETECTION: IC4 IC6 IC8 IC9
RELAY MECHANICAL STATE DETECTION: IC5
VOLTAGE REFERENCE: R15 R19 R24 R27-R29 R31 R32

### Ports
+5V ISO (see Green_Light_Check[5B], Red_Light_Check[3C], Red_Light_Check[4B], TSAC_Logic[4B]), +5V ISO (see Green_Light_Check[5B], Red_Light_Check[3C], Red_Light_Check[4B], TSAC_Logic[5A]), AIR+COIL (see Green_Light_Check[2D]), AIR-COIL (see Green_Light_Check[2D]), AIRAUX+ (see Green_Light_Check[2D]), AIRAUX- (see Green_Light_Check[2D]), Green Light Check (see Green_Light_Check[3D], Green_Light_Check[4C]), PREAUX (see Green_Light_Check[3D]), PRECOIL (see Green_Light_Check[3D]), TS Status (see Green_Light_Check[3D], Green_Light_Check[4C])

### Nets
+3.3V: R14.2 R18.2 R22.2
+5: IC4.3(VCC) IC5.3(VCC) IC6.14(VDD) IC8.5(VCC) IC9.2(V+) R15.1 R24.2 R27.1 R29.1 U1.4(C) U3.16(VCC)
+12: R30.2
AIR+/AUX-: IC4.12(GND) IC5.12(GND) IC6.7(VSS) IC8.3(GND) IC9.5(V-) J1.2 J2.2 J3.2 R17.2 R19.1 R21.2 R26.2 R28.1 R31.1 R32.1 R41.2 U3.8(GND)  [also labelled AIR-/AUX-, GND, PRE/AUX-]
HV-: IC2.5(V-) U1.2(C) VR1.1(A)
+5V ISO: IC2.2(V+) R8.1 ; port +5V ISO
AIR+: IC4.1(1OUT) IC6.6(2B)
AIR+/AUX+: IC5.5(2IN+) J1.1 R18.1
AIR+/COIL-: IC4.7(1IN+) R20.2 R21.1
AIR+COIL: IC6.4(2Y) U3.1(A) U3.14(L) U3.15(M) ; port AIR+COIL
AIR-: IC4.13(OUT4) IC6.13(4B)
AIR-/AUX+: IC5.7(1IN+) J3.1 R14.1
AIR-/COIL-: IC4.11(4IN+) R16.2 R17.1
AIR-COIL: IC6.11(4Y) U3.2(B) U3.13(K) ; port AIR-COIL
AIRAUX+: IC5.2(2OUT) U3.4(D) U3.11(I) ; port AIRAUX+
AIRAUX-: IC5.1(1OUT) U3.5(E) U3.10(H) ; port AIRAUX-
COIL+: IC4.5(2IN+) IC9.3(IN+) R30.1 R33.2 R41.1
COIL_VREF: IC4.6(1IN-) IC4.8(3IN-) IC4.10(4IN-) R29.2 R31.2
Green Light Check: U1.3(E) ; port Green Light Check
HV+/Accumulator: F1.1 J6.1
HV-/Accumulator: J6.2 R7.1
PRE: IC4.14(OUT3) IC6.9(3B)
PRE/AUX+: IC5.9(3IN+) J2.1 R22.1
PRE/COIL-: IC4.9(3IN+) R25.2 R26.1
PREAUX: IC5.14(OUT3) U3.6(F) U3.7(G) ; port PREAUX
PRECOIL: IC6.10(3Y) U3.3(C) U3.12(J) ; port PRECOIL
SDC: IC6.5(2A) IC6.8(3A) IC6.12(4A) IC8.4(Y)
SDC_1: IC4.2(2OUT) IC8.2(B)
SDC_VREF_1: IC4.4(2IN-) R27.2 R32.2
SDC_VREF_2: IC9.4(IN-) R15.2 R19.2
TS Status: U3.9(Y) ; port TS Status
VREF: IC5.4(2IN-) IC5.6(1IN-) IC5.8(3IN-) R24.1 R28.2
NetF1_2: F1.2 R1.2
NetIC2_1: IC2.1(OUT) U1.1(A)
NetIC2_3: IC2.3(IN+) R3.1 R7.2
NetIC2_4: IC2.4(IN-) VR1.2(B)
NetIC8_1: IC8.1(A) IC9.1(OUT)
NetJ1_3: J1.3 R20.1
NetJ2_3: J2.3 R25.1
NetJ3_3: J3.3 R16.1
NetJ8_1: J8.1 R33.1
NetR1_1: R1.1 R3.2
NetR8_2: R8.2 VR1.3(C)

Not connected (* = marked no-connect by the designer): IC5 10(4IN-)* 11(4IN+)* 13(OUT4)*; IC6 1(1A)* 2(1B)* 3(1Y)*; J8 2* 3*

### Notes on the sheet
- TSAC Logic
- (near R8) 10k
- (near R1) 100k
- (near R3) 100k
- (near R14) 3.3k
- (near R16) 6.5k
- (near R7) 2.49k
- (near R17) 4k
- (near R18) 3.3k
- -PIN 3 of J1,J2,J3 are connected to the negative side of the relay's coil. When the relay is closed or there is a broken wire, signal at @{"Id":"INWXCATM\EQKFYVVP","ObjectType":1}, @{"Id":"INWXCATM\YCXYRFVM","ObjectType":1}  and @{"Id":"INWXCATM\GOHPUVJL","ObjectType":1} is almost zero and the output of IC4 is LOW (TS ON). When there are no faults, voltage at these points is higher than 0.47V (TS OFF)
  -PIN 1 of J8 connector is connected on the positive side of the relay coils (AIR+,AIR- and Precharge). When LVS is ON and TSMS OFF, voltage at @{"Id":"INWXCATM\HLKXTYPZ","ObjectType":1} is 1.89V. When LVS is ON anf TSMS is ON voltage at @{"Id":"INWXCATM\HLKXTYPZ","ObjectType":1} is 3.42V. If there is a fault then the signal is 2V. In order to detect the fault, we use two comparators, IC4(2OUT) and IC9 and their outputs are inputs to IC8(OR GATE). The output on both is LOW (TS ON) when the fault is detected and so output of IC8 is LOW (TS ON). When there are no faults ,one of the outputs of IC4 or IC9 is HIGH and thus IC8 is HIGH.
  -Outputs from IC8 and IC4 are inputs to IC6 (AND GATE). When there are no faults, all inputs are HIGH and thus output is HIGH so TS is OFF. If there is a fault or at least one relay is closed, output of IC6 is LOW so TS is ON.
- (near R20) 6.5k
- (near IC6) AND GATE
- (near U3) TS ON
- (near U3) TS OFF
- (near R21) 4k
- TS OFF
- TS ON
- (near R22) 3.3k
- (near R25) 10k
- (near R25) 6.5k
- (near R26) 4k
- (near R27) 5k
- (near R15) 5k
- (near R29) 5k
- (near R24) 10k
- (near R30) 5k
- (near R33) 5k
- @{"Id":"INWXCATM\YDIZUGXC","ObjectType":1} , @{"Id":"INWXCATM\ZYDAUAYM","ObjectType":1}, @{"Id":"INWXCATM\IXORWXWO","ObjectType":1} : These three are connected to the positive auxiliary contacts of the three relays. When the contacts are closed the input signal on the IC5(Comparator) is LOW and when the contacts are open, the input signal is HIGH via the R14,R18,R22. When the wire is broken, the input is also HIGH.
- (near R28) 10k
- (near R32) 3.6k
- (near R19) 3.3k
- (near R31) 350R
- (near R41) 1k
- TITLE
- DATE
- DRAWN BY
- CAR NUMBER
- SIZE
- REV
- SHEET
- A3
- /

### Library data of the parts
F1 = 0ADAP0200-RE: Fuse; Manufacturer_Name: BelFuse; Datasheet Link: https://www.belfuse.com/resources/datasheets/circuitprotection/ds-cp-0adax-series.pdf; Height: 7.06mm; Manufacturer_Part_Number: 0ADAP0200-RE; Mouser Part Number: 530-0ADAP0200-RE; Mouser Price/Stock: https://www.mouser.co.uk/ProductDetail/Bel-Fuse/0ADAP0200-RE?qs=chTDxNqvsylLbV%252B5gr9f%252Bw%3D%3D; Arrow Part Number: 0ADAP0200-RE; Arrow Price/Stock: https://www.arrow.com/en/products/0adap0200-re/bel-group
IC2 IC9 = TLV1811LDBVR: as IC7 on sheet Red_Light_Check; Datasheet Link: https://www.ti.com/lit/ds/symlink/tlv1811.pdf?ts=1674252464539&ref_url=https%253A%252F%252Fwww.ti.com%252Fproduct%252FTLV1811; Height: 1.45mm; Manufacturer_Part_Number: TLV1811LDBVR; Mouser Part Number: 595-TLV1811LDBVR; Mouser Price/Stock: https://www.mouser.co.uk/ProductDetail/Texas-Instruments/TLV1811LDBVR?qs=rQFj71Wb1eX09MzTfpxERg%3D%3D; Arrow Part Number: TLV1811LDBVR; Arrow Price/Stock: https://www.arrow.com/en/products/tlv1811ldbvr/texas-instruments?region=nac
IC4 IC5 = LM339N: Integrated Circuit; Manufacturer_Name: Texas Instruments; Datasheet Link: https://componentsearchengine.com/Datasheets/2/LM339N.pdf; Height: 5.08mm; Manufacturer_Part_Number: LM339N; Mouser Part Number: 595-LM339N; Mouser Price/Stock: https://www.mouser.co.uk/ProductDetail/Texas-Instruments/LM339N?qs=rshUhwi3fbY%252BaR%252BOl3edNw%3D%3D; Arrow Part Number: LM339N; Arrow Price/Stock: https://www.arrow.com/en/products/lm339n/texas-instruments?region=nac
IC6 = HEF4081BT,653: Integrated Circuit; Manufacturer_Name: Nexperia; Datasheet Link: https://assets.nexperia.com/documents/data-sheet/HEF4081B.pdf; Height: 1.75mm; Manufacturer_Part_Number: HEF4081BT,653; Mouser Part Number: 771-HEF4081BTD-T; Mouser Price/Stock: https://www.mouser.co.uk/ProductDetail/Nexperia/HEF4081BT653?qs=me8TqzrmIYWQmKgk7FpcUw%3D%3D; Arrow Part Number: HEF4081BT,653; Arrow Price/Stock: https://www.arrow.com/en/products/hef4081bt653/nexperia?region=europe
IC8 = SN74AHC1G32DCKRE4: Integrated Circuit; Manufacturer_Name: Texas Instruments; Datasheet Link: https://www.arrow.com/en/products/sn74ahc1g32dckre4/texas-instruments; Height: 1.1mm; Manufacturer_Part_Number: SN74AHC1G32DCKRE4; Mouser Part Number: 595-74AHC1G32DCKRE4; Mouser Price/Stock: https://www.mouser.co.uk/ProductDetail/Texas-Instruments/SN74AHC1G32DCKRE4?qs=fSCvMSq5ISXKX2gb0IHBGA%3D%3D; Arrow Part Number: SN74AHC1G32DCKRE4; Arrow Price/Stock: https://www.arrow.com/en/products/sn74ahc1g32dckre4/texas-instruments
J1-J3 J8 = CMP-04776-000410-1: as J4 on sheet Green_Light_Check; Contact Material: Brass; Series: KK; Number of Positions: 3; Contact Gender: Male; Mount: Through Hole; Working Voltage: 250V; Number of Poles: 3; Termination: Solder; Radiation Hardening: No; Lead Free: Lead Free; Min Operating Temperature: -40°C; Contact Mating Length: 0.295inch; Packaging: Bulk; Lead Pitch: 2.5mm; Voltage Rating: 250V; Voltage Rating (DC): 250V; Orientation: Straight; Color: Natural; Flammability Rating: UL94 V-0; Housing Material: Nylon; Pitch: 2.5mm; Contact Type: Male Pin; Number of Rows: 1; Housing Color: Natural; Max Operating Temperature: 105°C; Fastening Type: Friction; Halogen Free: Low Halogen; Contact Plating: Tin; Package Quantity: 1; Number of Circuits: 3
J6 = 43045-0213: Connector; Manufacturer_Name: Molex; Datasheet Link: https://www.molex.com/pdm_docs/sd/430450612_sd.pdf; Height: 9.91mm; Manufacturer_Part_Number: 43045-0213; Mouser Part Number: 538-43045-0213; Mouser Price/Stock: https://www.mouser.co.uk/ProductDetail/Molex/43045-0213?qs=4XSMV6Twtb2ziNgaS7IgsA%3D%3D
R1 R3 = ERJHP6D1003V: Resistor; Manufacturer_Name: Panasonic; Datasheet Link: http://industrial.panasonic.com/cdbs/www-data/pdf/RDQ0000/ast-ind-151033.pdf; Height: 0.7mm; Manufacturer_Part_Number: ERJHP6D1003V
R7 = ERJHP6D2491V: Resistor; Manufacturer_Name: Panasonic; Datasheet Link: http://industrial.panasonic.com/cdbs/www-data/pdf/RDQ0000/ast-ind-151033.pdf; Height: 0.7mm; Manufacturer_Part_Number: ERJHP6D2491V
R8 R24 R28 = CMP-1013-00623-2: Manufacturer: Vishay Dale; Part Number: CRCW080510K0FKEC
R14 R18 R22 = CMP-02407-006791-1: RES Thick Film, 3.3kΩ, 1%, 0.125W, 100ppm/°C, 0805; Resistance: 3.3kR; Max Power Dissipation: 125mW; Width: 0.049inch; Height: 0.02inch; Contact Plating: Tin; Package Quantity: 20000; Features: Automotive AEC-Q200; Max Operating Temperature: 155°C; Packaging: Tape and Reel; Composition: Thick Film; Temperature Coefficient: 100ppm/°C; Tolerance: 1%; Number of Terminations: 2; Radiation Hardening: No; Length: 0.079inch; Lead Free: Lead Free; Min Operating Temperature: -55°C; Case/Package: 0805
R15 R27 R29 R30 = CMP-02407-010660-1: RES Thick Film, 20kΩ, 5%, 0.125W, 200ppm/°C, 0805; Voltage Rating: 150V; Resistance: 20kR; Max Power Dissipation: 125mW; Case/Package: 0805; Number of Terminations: 2; Features: Automotive AEC-Q200; Tolerance: 5%; Height: 0.02inch; Case Code (Metric): 2012; Temperature Coefficient: 200ppm/°C; Max Operating Temperature: 155°C; Min Operating Temperature: -55°C; Length: 0.079inch; Weight: 0.000194oz; Case Code (Imperial): 0805; Composition: Thick Film; Width: 1.25mm; Lead Free: Lead Free; Power Rating: 125mW; Packaging: Tape and Reel; Termination: SMD/SMT; Package Quantity: 10000
R16 R19 R20 R25 R32 R33 = CMP-2003-04807-2: as R10 on sheet Green_Light_Check; Tolerance: 1%; Width: 0.063inch; Height: 0.55mm; Number of Pins: 2; Voltage Rating: 200V; Temperature Coefficient: 100ppm/°C; Military Standard: Not; Features: Automotive AEC-Q200; Depth: 1.6mm; Radiation Hardening: No; Termination: SMD/SMT; Case Code (Imperial): 1206; Weight: 0.000353oz; Length: 3.2mm; Package Quantity: 10; Voltage Rating (DC): 200V; Case/Package: 1206; Min Operating Temperature: -55°C; Number of Terminations: 2; Composition: Thick Film; Contact Plating: Tin; Power Rating: 250mW; Packaging: Tape and Reel; Max Operating Temperature: 155°C; Lead Free: Lead Free; Case Code (Metric): 3216
R17 R21 R26 R41 = CMP-04015-032713-1: 4kΩ ±0.1% 0.125W, 1/8W Chip Resistor 1206 (3216 Metric) Moisture Resistant Thin Film; Temperature Coefficient: 25ppm/°C; Power Rating: 125mW; Voltage Rating: 150V; Resistance: 4kR; Length: 3.2mm; Termination: SMD/SMT; Case/Package: 1206; Composition: Thin Film; Min Operating Temperature: -55°C; Packaging: Tape and Reel; Width: 1.6mm; Case Code (Metric): 3216; Case Code (Imperial): 1206; Tolerance: 0.1%; Height: 0.6mm; Max Operating Temperature: 125°C; Weight: 0.000571oz
R31 = CMP-02407-008722-1: Res MC Precision Thin Film 1206 800Ω 0.1% 0.25W ±25ppm/°C Molded Paper T/R; Resistance: 800R; Max Power Dissipation: 250mW; Lead Free: Lead Free; Package Quantity: 5000; Composition: Thin Film; Tolerance: 0.1%; Number of Terminations: 2; Length: 0.126inch; Width: 0.063inch; Max Operating Temperature: 125°C; Packaging: Tape and Reel; Min Operating Temperature: -55°C; Case/Package: 1206; Temperature Coefficient: 25ppm/°C; Height: 0.026inch
U1 = CMP-00030-45523145-1: as U6 on sheet Red_Light_Check; Lead Free: Lead Free; Case/Package: SOP; Mount: Surface Mount; Min Operating Temperature: -55°C; Radiation Hardening: No; Width: 3.85mm; REACH SVHC: Unknown; Schedule B: 8541408000, 8541408000; Number of Pins: 4; Collector Emitter Breakdown Voltage: 80V; Forward Current: 60mA; Number of Channels: 1; RoHS: Compliant; Power Dissipation: 170mW; NexarPartId: 45523145; Length: 4.4mm; Input Current: 60mA; Collector Emitter Voltage (VCEO): 80V; Max Operating Temperature: 110°C; Output Voltage: 80V; Packaging: Tape & Reel; Max Collector Current: 100mA; Height: 2mm; Reverse Voltage (DC): 6V
U3 = CMP-1627-00566-2: 13-Input Positive-NAND Gates, NS0016A, LARGE T&R; Manufacturer: Texas Instruments; Output Drive (IOL/IOH)(Max)(mA): 0.4/-8; Voltage(Nom)(V): 5; Technology Family: ALS; tpd @ Nom Voltage(Max)(ns): 25; Input Type: TTL; VCC(Max)(V): 5.5; VCC(Min)(V): 4.5; Schmitt Trigger: No; Bits(#): 1; F @ Nom Voltage(Max)(Mhz): 75; ICC @ Nom Voltage(Max)(mA): 0.00034; Rating: Catalog; PackageReference: NS0016A; Generic Part Number: SN74ALS133; DatasheetVersion: SDAS202B; Output Type: TTL; Operating Temperature Range(C): 0 to 70
VR1 = T93YA103KT20: as VR2 on sheet Red_Light_Check; Datasheet Link: https://www.vishay.com/docs/51026/t93.pdf; Height: 9mm; Manufacturer_Part_Number: T93YA103KT20; Mouser Part Number: 72-T93YA-10K; Mouser Price/Stock: https://www.mouser.co.uk/ProductDetail/Vishay-Sfernice/T93YA103KT20?qs=h4f6qdGYbthXcbdd7vDO0Q%3D%3D; Arrow Part Number: T93YA103KT20; Arrow Price/Stock: https://www.arrow.com/en/products/t93ya103kt20/vishay?region=nac

## Sheet CI.SchDoc: TSAL Cockpit Indicator
size 420 x 297 mm; Date: 15/04/24; DrawnBy: Georgios Papandreou; Revision: 3; SheetNumber: 4; SheetTotal: 4; CarNum: E5; CurrentSheet: 1; TotalSheet: 1
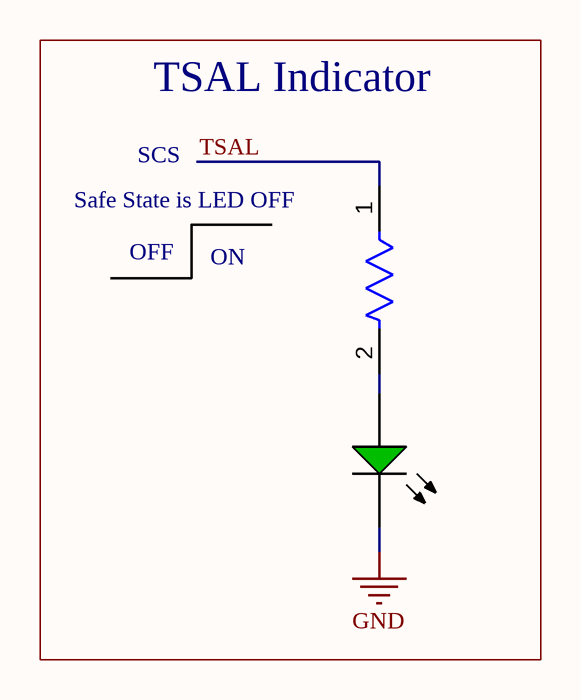
[diagram p3: CI.SchDoc]

### Parts
DS?  LTST-C170KGKT  [LTST-LTST-C170KGKT-2_V]  (value not drawn)
R?  CRCW120610K0FKEA  [FP-CRCW1206-e3-IPC_C]  (value not drawn)

### Blocks framed on the sheet
TSAL Indicator: DS? R?

### Nets
GND: DS?.1(K)  [project net AIR+/AUX-]
TSAL: R?.1
NetDS?_2: DS?.2(A) R?.2

### Notes on the sheet
- (near R?) Safe State is LED OFF
- SCS
- OFF
- ON
- TITLE
- DATE
- DRAWN BY
- CAR NUMBER
- SIZE
- REV
- SHEET
- A3
- /

### Library data of the parts
DS? = CMP-2000-06620-1: Ultra Bright AlInGaP Chip LED, 75 mW, -55 to 85 degC, 2-Pin SMD (0805), RoHS, Tape and Reel; Manufacturer: Lite-On; Forward Current: 30mA; Power Dissipation Max: 75mW; Emitting Color: YellowGreen; Type: Uni-Color; Forward Voltage: 2.4V; Dominant Wave Length: 571nm; Test Current (It): 20mA; Product Length (mm): 2mm; Peak Wavelength: 574nm; Power Dissipation: 75W; Product Depth (mm): 1.25mm; DELETED: Compliant; High Brightness: Yes; Product Height (mm): 1.1mm; Luminous Intensity: 35mcd; Shape Type: Rectangular; Chip Material: AlGaInP; Viewing Angle: 130deg; Number of  Elements: 1; Reverse Voltage: 5V; Rad Hardened: No; Package Type: ChipLed; Manufacturer URL: http://www.us.liteon.com/; Mounting: SurfaceMount; Operating Temp Range: -55Cto85C; Datasheet URL: http://optoelectronics.liteon.com/upload/download/DS22-2000-073/S_110_LTST-C170KGKT.pdf; Packaging: TapeandReel; Pin Count: 2; Package Description: 2-Pin Surface Mounted Device, Body 2 x 1.25 mm; Mounting Technology: SurfaceMount; Package Reference: LTST-C170KGKT-2; Forward Current Max: 30mA; Datasheet Version: Rev. G, 06/2005; Lens Dimensions: 1.4x1.25x0.6mm; Operating Temperature Classification: Industrial; Lum Intensity: 35mcd; Main Category: ChipLED
R? = CMP-2003-04807-2: as R10 on sheet Green_Light_Check; Tolerance: 1%; Width: 0.063inch; Height: 0.55mm; Number of Pins: 2; Voltage Rating: 200V; Temperature Coefficient: 100ppm/°C; Military Standard: Not; Features: Automotive AEC-Q200; Depth: 1.6mm; Radiation Hardening: No; Termination: SMD/SMT; Case Code (Imperial): 1206; Weight: 0.000353oz; Length: 3.2mm; Package Quantity: 10; Voltage Rating (DC): 200V; Case/Package: 1206; Min Operating Temperature: -55°C; Number of Terminations: 2; Composition: Thick Film; Contact Plating: Tin; Power Rating: 250mW; Packaging: Tape and Reel; Max Operating Temperature: 155°C; Lead Free: Lead Free; Case Code (Metric): 3216

## Nets that join several sheets
+3.3V: Green_Light_Check (C3.2 U4.4), TSAC_Logic (R14.2 R18.2 R22.2)
+5: Green_Light_Check (12 pins), Red_Light_Check (U6.4), TSAC_Logic (11 pins)
+12: Green_Light_Check (12 pins), TSAC_Logic (R30.2)
AIR+/AUX-: Green_Light_Check (24 pins), Red_Light_Check (C8.1 U7.1), TSAC_Logic (17 pins), CI (DS?.1)
HV-: Green_Light_Check (PS1.9), Red_Light_Check (IC7.5 U6.2 VR2.1), TSAC_Logic (IC2.5 U1.2 VR1.1)
+5V ISO: Green_Light_Check (PS1.8), Red_Light_Check (IC7.2 R39.1), TSAC_Logic (IC2.2 R8.1)
AIR+COIL: Green_Light_Check (IC3.4), TSAC_Logic (IC6.4 U3.1 U3.14 U3.15)
AIR-COIL: Green_Light_Check (IC3.1), TSAC_Logic (IC6.11 U3.2 U3.13)
AIRAUX+: Green_Light_Check (IC3.5), TSAC_Logic (IC5.2 U3.4 U3.11)
AIRAUX-: Green_Light_Check (IC3.2), TSAC_Logic (IC5.1 U3.5 U3.10)
Green Light Check: Green_Light_Check (IC3.9 U2.9), TSAC_Logic (U1.3)
PREAUX: Green_Light_Check (IC3.12), TSAC_Logic (IC5.14 U3.6 U3.7)
PRECOIL: Green_Light_Check (IC3.13), TSAC_Logic (IC6.10 U3.3 U3.12)
RED LED: Green_Light_Check (J4.1), Red_Light_Check (U7.3)
TS Status: Green_Light_Check (IC3.10 U2.10), TSAC_Logic (U3.9)